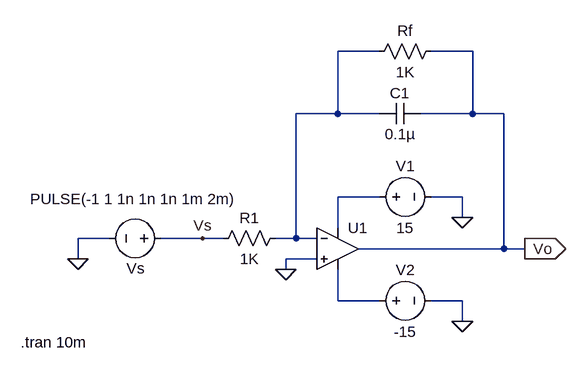
[diagram p0: schematic Run2_B.asc]
Run2_B.asc, the LTspice schematic file:
Version 4
SHEET 1 880 680
WIRE 304 -32 240 -32
WIRE 448 -32 384 -32
WIRE 240 64 240 -32
WIRE 240 64 176 64
WIRE 304 64 240 64
WIRE 448 64 448 -32
WIRE 448 64 368 64
WIRE 496 64 448 64
WIRE 304 192 240 192
WIRE 432 192 384 192
WIRE 432 224 432 192
WIRE 240 240 240 192
WIRE -112 256 -160 256
WIRE 32 256 -32 256
WIRE 64 256 32 256
WIRE 176 256 176 64
WIRE 176 256 144 256
WIRE 208 256 176 256
WIRE 496 272 496 64
WIRE 496 272 272 272
WIRE 528 272 496 272
WIRE -160 288 -160 256
WIRE 208 288 160 288
WIRE 160 304 160 288
WIRE 240 352 240 304
WIRE 304 352 240 352
WIRE 432 352 384 352
WIRE 432 384 432 352
FLAG 432 224 0
FLAG 432 384 0
FLAG -160 288 0
FLAG 160 304 0
FLAG 528 272 Vo
IOPIN 528 272 Out
FLAG 32 256 Vs
SYMBOL OpAmps\\UniversalOpamp2 240 272 R0
SYMATTR InstName U1
SYMBOL voltage 288 192 R270
WINDOW 0 32 56 VTop 2
WINDOW 3 -32 56 VBottom 2
WINDOW 123 0 0 Left 0
WINDOW 39 0 0 Left 0
SYMATTR InstName V1
SYMATTR Value 15
SYMBOL voltage 288 352 R270
WINDOW 0 32 56 VTop 2
WINDOW 3 -32 56 VBottom 2
WINDOW 123 0 0 Left 0
WINDOW 39 0 0 Left 0
SYMATTR InstName V2
SYMATTR Value -15
SYMBOL res 160 240 R90
WINDOW 0 0 56 VBottom 2
WINDOW 3 32 56 VTop 2
SYMATTR InstName R1
SYMATTR Value 1K
SYMBOL voltage -16 256 R90
WINDOW 0 62 55 VBottom 2
WINDOW 3 -76 58 VTop 2
WINDOW 123 0 0 Left 0
WINDOW 39 0 0 Left 0
SYMATTR InstName Vs
SYMATTR Value PULSE(-1 1 1n 1n 1n 1m 2m)
SYMBOL cap 368 48 R90
WINDOW 0 0 32 VBottom 2
WINDOW 3 32 32 VTop 2
SYMATTR InstName C1
SYMATTR Value 0.1µ
SYMBOL res 400 -48 R90
WINDOW 0 0 56 VBottom 2
WINDOW 3 32 56 VTop 2
SYMATTR InstName Rf
SYMATTR Value 1K
TEXT -248 416 Left 2 !.tran 10m

The netlist it stands for:
* Run2_B.asc
XU1 0 N001 N002 N003 Vo level.2 Avol=1Meg GBW=10Meg Slew=10Meg ilimit=25m rail=0 Vos=0 phimargin=45 en=0 enk=0 in=0 ink=0 Rin=500Meg  ; pins IN+ IN- V+ V- OUT
V1 N002 0 15
V2 N003 0 -15
R1 N001 Vs 1K
Vs Vs 0 PULSE(-1 1 1n 1n 1n 1m 2m)
C1 Vo N001 0.1µ
Rf Vo N001 1K
.tran 10m
.lib UniversalOpamps2.sub
.backanno
.end